# Altium schematic sheet CATS-FAT-Baro.SchDoc: CATS Pro
size A4; Author: Luca Jost; Revision: 1.0; SheetNumber: 11; SheetTotal: 13; Subtitle: Barometric Sensor
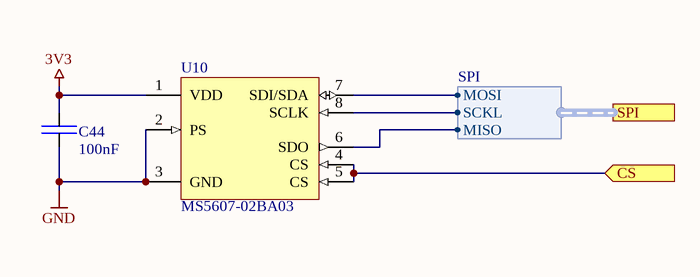
[diagram p0: CATS-FAT-Baro.SchDoc]

## Parts
C44  100nF  [SMD Keramikkondensator 0603]
U10  MS5607-02BA03  [SMD IC BARO MS5607]

## Ports
CS (in), SPI (harness SPI)

## Harnesses
SPI: SCKL, MOSI, MISO

## Nets
3V3: C44.2 U10.1(VDD)
GND: C44.1 U10.2(PS) U10.3(GND)
CS: U10.4(CS) U10.5(CS) ; port CS
NetU10_6: U10.6(SDO) ; port SPI.MISO
NetU10_7: U10.7(SDI/SDA) ; port SPI.MOSI
NetU10_8: U10.8(SCLK) ; port SPI.SCKL

## Notes on the sheet
- Title
- Author:
- Subtitle
- Date:
- Rev:
- CATS
- Sheet
- of
- File:

## Library data of the parts
C44 = E6 - 100nF: SMD Ceramic Capacitor E6; Unit Price: 0.01; Number: -; Supplier: -
U10 = MS5607-02BA03: Barometric Pressure Sensor, with stainless / steel cap; ComponentLink1Description: Datasheet; ComponentLink1URL: https://www.te.com/commerce/DocumentDelivery/DDEController?Action=srchrtrv&DocNm=MS5607-02BA03&DocType=Data+Sheet&DocLang=English; Digikey: 223-1198-1-ND